# Altium schematic sheet Structural sheme.SchDoc
size 420 x 297 mm; Address1: Address1; Address2: Address2; Address3: Address3; Address4: Address4; DocumentNumber: SSI.DB.0.001; SheetNumber: 1; Scale: 1:1; DocumentType: Схема электрическая принципиальная; FirstReferrence: АБВГ.123456.001
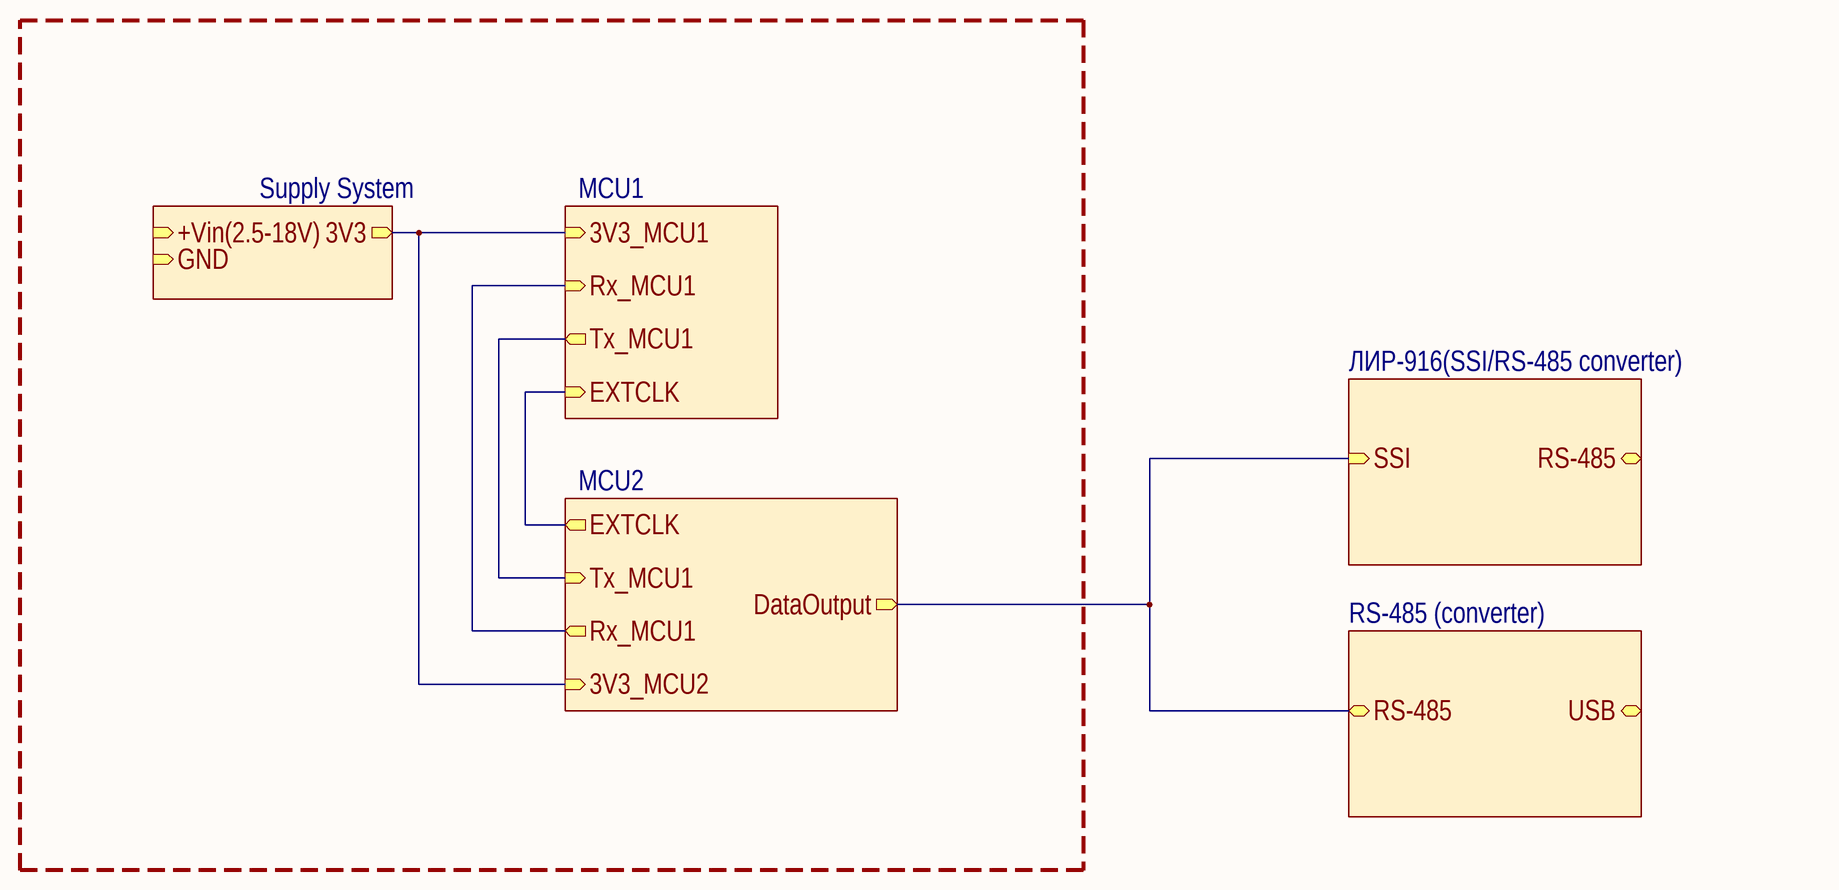
[diagram p0: Structural sheme.SchDoc]

## Sub-sheets
MCU1 = MCU1.SchDoc: 3V3_MCU1 (in), Tx_MCU1 (out), Rx_MCU1 (in), EXTCLK (in)
MCU2 = MCU2.SchDoc: EXTCLK (out), Rx_MCU1 (out), Tx_MCU1 (in), 3V3_MCU2 (in), DataOutput (out)
RS-485 (converter) = File Name: RS-485 (bidir), USB (bidir)
Supply System = Supply System.SchDoc: 3V3 (out), +Vin(2.5-18V) (in), GND (in)
ЛИР-916(SSI/RS-485 converter) = File Name: SSI (in), RS-485 (bidir)

## Nets
(unnamed): sheet ЛИР-916(SSI/RS-485 converter)/SSI, sheet RS-485 (converter)/RS-485, sheet MCU2/DataOutput
(unnamed): sheet MCU1/3V3_MCU1, sheet MCU2/3V3_MCU2, sheet Supply System/3V3
(unnamed): sheet MCU1/Tx_MCU1, sheet MCU2/Tx_MCU1
(unnamed): sheet MCU1/Rx_MCU1, sheet MCU2/Rx_MCU1
(unnamed): sheet MCU1/EXTCLK, sheet MCU2/EXTCLK

## Notes on the sheet
- Перв. примен.
- Справ. №
- Подп. и дата
- Инв. № дубл.
- Взам. инв. №
- Разраб.
- Изм.
- Лист
- № докум.
- Подп.
- Дата
- Лит.
- Масса
- Масштаб
- Пров.
- Т.контр.
- Листов
- Инв. № подл.
- Утв.
- Н.контр.
- 2.106-A3
- Копировал
- Формат А3